# EAGLE design i2c-servo (EAGLE 6.6.0)
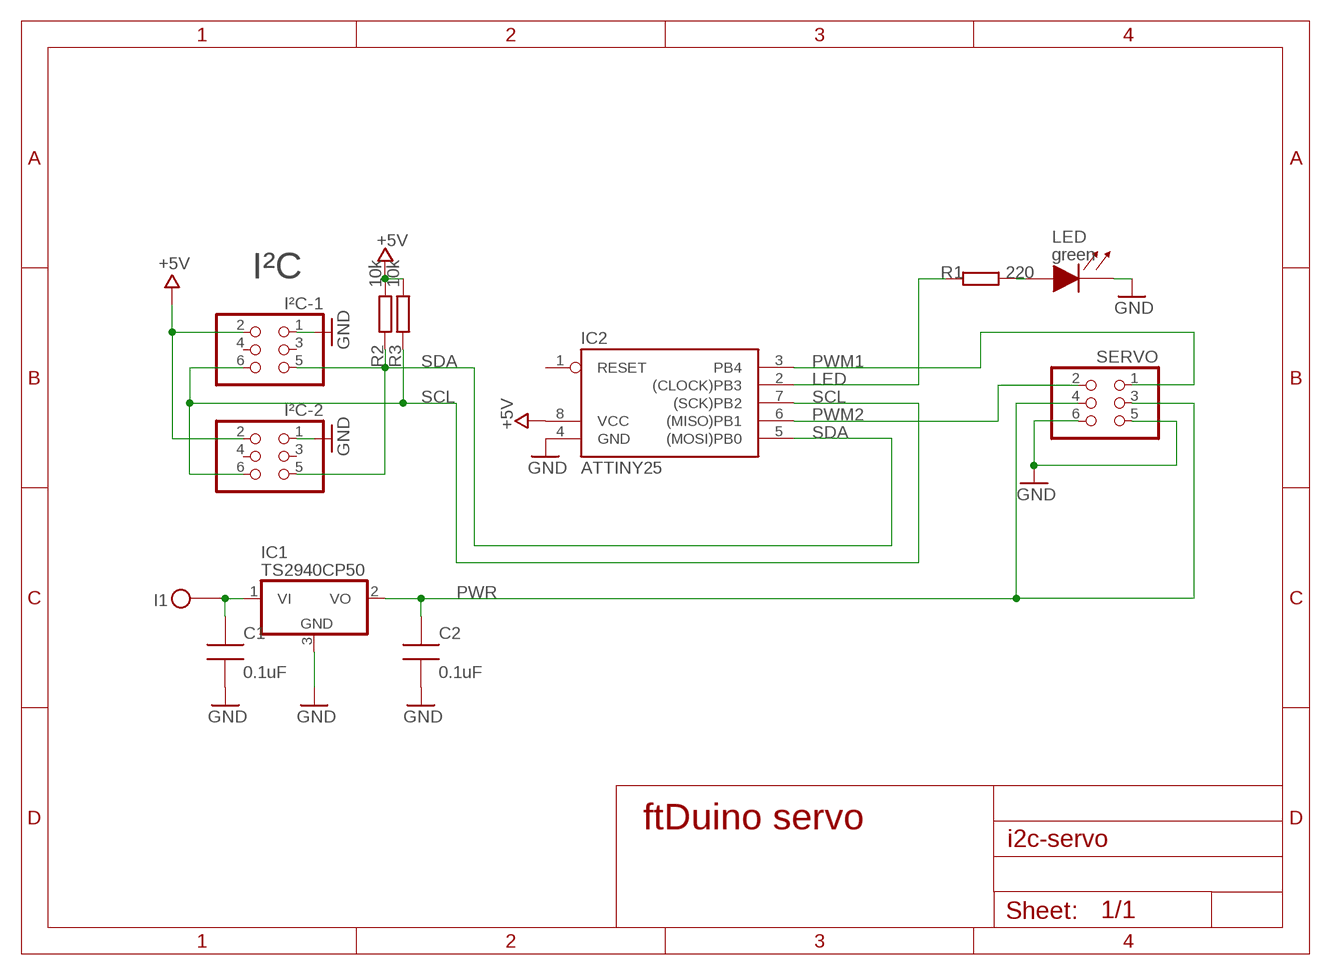
[diagram p0: schematic, sheet 1]

## Parts
C1  0.1uF  CAP0805-NP  [CAP0805-NP]
C2  0.1uF  CAP0805-NP  [CAP0805-NP]
H5  I1  FT-HUELSE  [FT-HUELSE]
IC1  TS2940CP50  7805DT  [TO252]
IC2  ATTINY25  TINY22S  [SOIC8]
I²C-1  PINHD-2X3_2.54-SMD  [2X03SMD]
I²C-2  PINHD-2X3_2.54-SMD  [2X03SMD]
LED  green  LED0805  [LED0805]
R1  220  R-EU_M0805  [M0805]
R2  10k  R-EU_M0805  [M0805]
R3  10k  R-EU_M0805  [M0805]
SERVO  PINHD-2X3_2.54-SMD  [2X03SMD]

## Nets
+5V: IC2.8(VCC) I²C-1.2 I²C-2.2 R2.2 R3.2
GND: C1.2 C2.2 IC1.3(GND) IC2.4(GND) I²C-1.1 I²C-2.1 LED.1(CA) SERVO.5 SERVO.6
LED: IC2.2((CLOCK)PB3) R1.1
N$3: C1.1 H5.D1 IC1.1(VI)
N$19: LED.2(AN) R1.2
PWM1: IC2.3(PB4) SERVO.1
PWM2: IC2.6((MISO)PB1) SERVO.2
PWR: C2.1 IC1.2(VO) SERVO.3 SERVO.4
SCL: IC2.7((SCK)PB2) I²C-1.6 I²C-2.6 R3.1
SDA: IC2.5((MOSI)PB0) I²C-1.5 I²C-2.5 R2.1
Unconnected: IC2.1(RESET) I²C-1.3 I²C-1.4 I²C-2.3 I²C-2.4

## Notes on the sheet
- I²C
- ftDuino servo

## Library data of the parts
C1 C2 = MySMD:CAP0805-NP
H5 = ft-huelse:FT-HUELSE
IC1 = linear:78*: Positive VOLTAGE REGULATOR Source: http://cache.national.com/ds/LM/LM78L05.pdf http://www.fairchildsemi.com/ds/LM/LM7805.pdf
IC2 = atmel:TINY22: MICROCONTROLLER 1K ROM 128 bytes RAM 128 bytes EEPROM; OC_FARNELL: unknown; OC_NEWARK: unknown
I²C-1 I²C-2 SERVO = pinhead-1:PINHD-2X3: PIN HEADER
LED = MySMD:LED0805
R1 = SmartPrj:R-EU_: RESISTOR, European symbol
R2 R3 = resistor:R-EU_: RESISTOR, European symbol

## Board
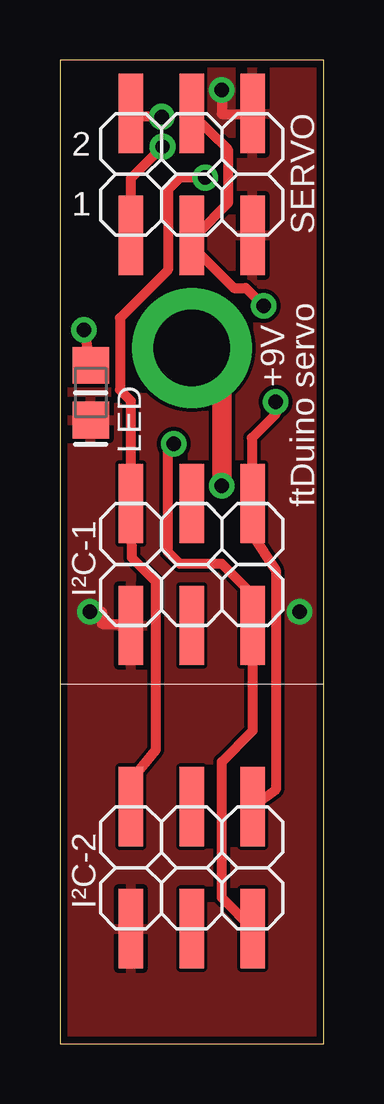
[diagram p1: board, top side]
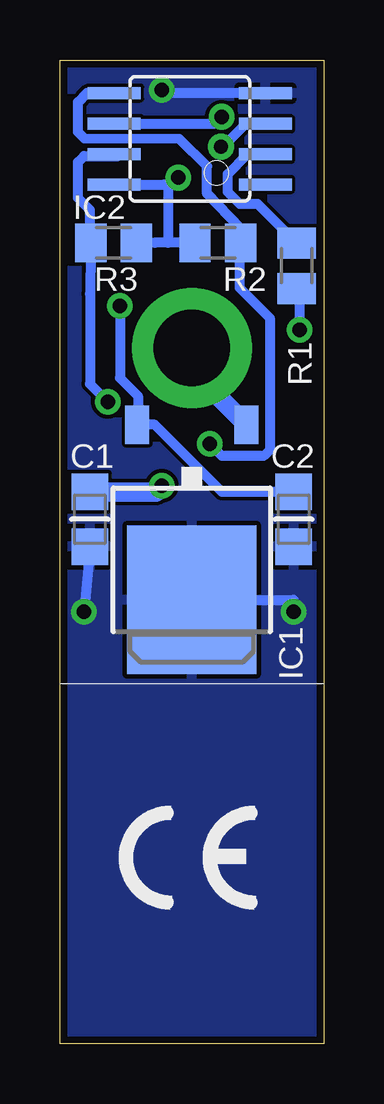
[diagram p2: board, bottom side, seen from below]

Size 11 x 41 mm. Coordinates in mm from the lower left corner, seen from the top.
Outline: 0,0 11,0 11,41 0,41 0,0
Copper layers (1*16): Top 0.035mm / dielectric 1.5mm / Bottom 0.035mm
Design rules "PCB-POOL Standard": minimum track width 0.15mm, minimum drill 0.3mm, track to track 0.15mm, track to pad 0.15mm, pad to pad 0.15mm, via to via 0.15mm, smd to smd 0.15mm, copper to edge 0.3mm, drill to drill 0.2mm, minimum pad ring 0.2mm, minimum via ring 0.15mm, stop-mask expansion 0.075mm, vias tented up to drill 0mil, thermal gap 0.2mm

### Footprints (pad centres in the part's own frame; a part is rotated, then mirrored left to right if it is on the bottom)
CAP0805-NP = smd 1.524 x 1.524: 1 0,0; 2 2.286,0
FT-HUELSE = drill 3.2 pad 5: D1 0,0
TO252 = smd 1 x 1.6: 1 -2.28,-4.8; 2 2.28,-4.8 | smd 5.4 x 6.2: 3 0,2.5
SOIC8 = smd 0.5 x 2.2: 1 -1.905,-3.154; 2 -0.645,-3.154; 3 0.625,-3.154; 4 1.895,-3.154; 5 1.905,3.154; 6 0.635,3.154; 7 -0.635,3.154; 8 -1.905,3.154
2X03SMD = smd 1.016 x 3.302: 1 -1.27,-3.81; 2 -1.27,1.27; 3 1.27,-3.81; 4 1.27,1.27; 5 3.81,-3.81; 6 3.81,1.27
LED0805 = smd 1.524 x 1.524: 1 0,0; 2 2.286,0
M0805 = smd 1.3 x 1.6: 1 -0.95,0; 2 0.95,0

### Placement (x,y rotation side)
C1  9.75,23 270 bottom
C2  1.25,23 270 bottom
H5  5.5,29 0 top
IC1  5.5,21 180 bottom
IC2  5.58,37.71 90 bottom
I²C-1  4.23,21.24 0 top
I²C-2  4.23,8.6 0 top
LED  1.29,25.99 90 top
R1  1.13,32.42 270 bottom
R2  4.41,33.38 180 bottom
R3  8.76,33.37 0 bottom
SERVO  4.23,37.5 0 top

### Tracks (layer width: path | path; a pad name or v marks a point on that pad's centre or on a via)
+5V  (via drill 0.6)
  Top 0.406: I²C-2.2 2.96,10.96 4,12.25 4,19.25 3,20.25 I²C-1.2 2.96,26.79 2.5,27.25 2.5,30.25 4.5,32.25 4.5,35.6 5,36.1 v6.06,36.1
  Bottom 0.406: R2.2 6.5,33.38 | 6.5,33.38 7.05,33.38 R3.2 | 6.5,35.66 6.5,33.38 | IC2.8 6.64,35.8 6.5,35.66 | 6.5,35.66 v6.06,36.1
GND  (via drill 0.6)
  Top 0.406: v1.25,18 1.75,18 1.75,17.5 2.96,17.5 I²C-1.1 | 8.04,38.75 SERVO.6 7.73,38.77 8,39.04 | v10,18 9.75,17.75 | v6.75,39.75 6.75,38.75 8,38.75 8,39.04 | 8,39.75 8,39.04
  Bottom 0.406: IC1.3 1.25,18.5 v1.25,18 | IC2.4 6.75,39.6 v6.75,39.75 | C1.2 v10,18
  pour Bottom: 0,0 0,41 11,41 11,0
  pour Top: 0,41 11,41 11,0 0,0
LED
  Bottom 0.406: R1.1 2.75,35 3.5,35 4,35.5 4,36.25 3.19,37.06 IC2.2
N$3  (via drill 0.6)
  Top 0.813: v6.75,23.25 6.75,27.75 H5.D1
  Bottom 0.813: H5.D1 5.5,28.08 IC1.1 | C1.1 7,23 v6.75,23.25
N$19  (via drill 0.6)
  Top 0.406: LED.2 1.04,29.71 v1,29.75
  Bottom 0.406: v1,29.75 1,31.34 R1.2
PWM1  (via drill 0.6)
  Top 0.406: SERVO.1 2.96,36.07 v4.28,37.39
  Bottom 0.406: v4.28,37.39 4.27,37.39 4.27,37.62 3.96,37.62 3.25,38.34 IC2.3
PWM2  (via drill 0.6)
  Top 0.406: v4.25,38.63 2.95,38.63 SERVO.2
  Bottom 0.406: IC2.6 4.54,38.34 v4.25,38.63
PWR  (via drill 0.6)
  Top 0.406: SERVO.4 5.5,38.75 7.01,37.27 7.01,35.02 5.69,33.69 SERVO.3 5.5,33.25 7.25,31.5 7.75,31.5 v8.5,30.75
  Bottom 0.406: v8.5,30.75 8.5,27.75 7.75,27 7.75,25.83 IC1.2 7.05,25.8 4.25,23 C2.1
SCL  (via drill 0.6)
  Top 0.406: v9,26.75 9,26.25 8,25.25 8,22.55 I²C-1.6 8.04,21.21 9,19.75 9,10.58 I²C-2.6
  Bottom 0.406: v9,26.75 9.75,27.5 9.75,31.25 9.71,33.04 R3.1 9.71,33.46 9.75,34.75 10.25,35.25 10.25,36.75 10,37 8.56,37 IC2.7
SDA  (via drill 0.6)
  Top 0.406: I²C-2.5 6.75,6.08 6.75,11.75 8.04,13.04 I²C-1.5 8.04,18.71 6.75,20 5,20 4.5,20.5 4.5,24.75 v4.75,25
  Bottom 0.406: IC2.5 9.88,39.62 10.25,39.25 10.25,38 9.97,37.73 6.01,37.7 4.86,36.57 4.86,35.42 3.46,33.96 R2.1 3.5,33.34 3.5,31.5 2.25,30.25 2.25,24.75 2.5,24.5 4.25,24.5 v4.75,25

### Text on the board
tPlace: 2 | 1 | +9V | ftDuino servo